# Altium schematic sheet Deserializer.SchDoc
size A
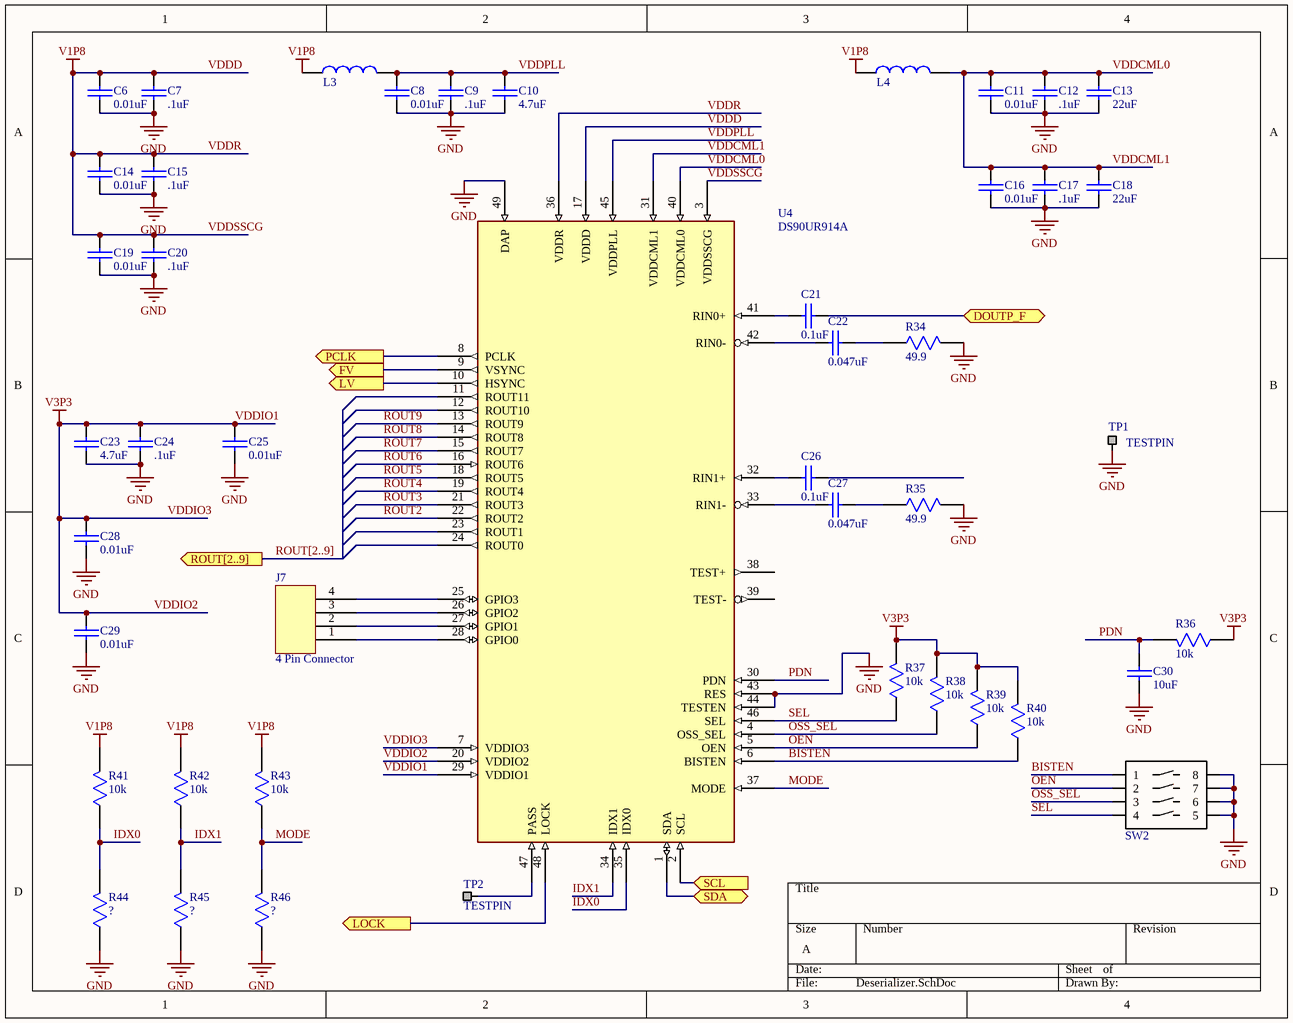
[diagram p0: Deserializer.SchDoc]

## Parts
C6  0.01uF  [SMD Capacitor 0603]
C7  .1uF  [SMD Capacitor 0603]
C8  0.01uF  [SMD Capacitor 0603]
C9  .1uF  [SMD Capacitor 0603]
C10  4.7uF  [SMD Capacitor 0603]
C11  0.01uF  [SMD Capacitor 0603]
C12  .1uF  [SMD Capacitor 0603]
C13  22uF  [SMD Capacitor 0603]
C14  0.01uF  [SMD Capacitor 0603]
C15  .1uF  [SMD Capacitor 0603]
C16  0.01uF  [SMD Capacitor 0603]
C17  .1uF  [SMD Capacitor 0603]
C18  22uF  [SMD Capacitor 0603]
C19  0.01uF  [SMD Capacitor 0603]
C20  .1uF  [SMD Capacitor 0603]
C21  0.1uF  [SMD CAP 0402]
C22  0.047uF  [SMD CAP 0402]
C23  4.7uF  [SMD Capacitor 0603]
C24  .1uF  [SMD Capacitor 0603]
C25  0.01uF  [SMD Capacitor 0603]
C26  0.1uF  [SMD CAP 0402]
C27  0.047uF  [SMD CAP 0402]
C28  0.01uF  [SMD Capacitor 0603]
C29  0.01uF  [SMD Capacitor 0603]
C30  10uF  [SMD Capacitor 0603]
J7  4 Pin Connector  [4Pin Verital 0.1"]
L3  Ferrite Bead  [BLM18KG601SN1D]  (value not drawn)
L4  Ferrite Bead  [BLM18KG601SN1D]  (value not drawn)
R34  49.9  [SMD RES 0402]
R35  49.9  [SMD RES 0402]
R36  10k  [SMD Resistor 0603]
R37  10k  [SMD Resistor 0603]
R38  10k  [SMD Resistor 0603]
R39  10k  [SMD Resistor 0603]
R40  10k  [SMD Resistor 0603]
R41  10k  [SMD Resistor 0603]
R42  10k  [SMD Resistor 0603]
R43  10k  [SMD Resistor 0603]
R44  ?  [SMD Resistor 0603]
R45  ?  [SMD Resistor 0603]
R46  ?  [SMD Resistor 0603]
SW2  SW_DIP_4Position  [218-4LPST]  (value not drawn)
TP1  TESTPIN  [TESTPIN]
TP2  TESTPIN  [TESTPIN]
U4  DS90UR914A  [WQFN48 for DS90UB914A]

## Ports
DOUTP_F (bidir), FV (out), LOCK (out), LV (out), PCLK (out), ROUT[2..9] (out), SCL (in), SDA (bidir)

## Nets
GND: C6.1 C7.1 C8.1 C9.1 C10.1 C11.1 C12.1 C13.1 C14.1 C15.1 C16.1 C17.1 C18.1 C19.1 C20.1 C23.1 C24.1 C25.1 C28.1 C29.1 C30.1 R34.1 R35.1 R44.0 R45.0 R46.0 SW2.5 SW2.6 SW2.7 SW2.8 TP1.1 U4.43(RES) U4.44(TESTEN) U4.49(DAP)
VDDD: C6.0 C7.0 C14.0 C15.0 C19.0 C20.0 L3.1 L4.1 R41.1 R42.1 R43.1 U4.3(VDDSSCG) U4.17(VDDD) U4.36(VDDR)  [also labelled V1P8, VDDR, VDDSSCG]
VDDIO1: C23.0 C24.0 C25.0 C28.0 C29.0 R36.0 R37.1 R38.1 R39.1 R40.1 U4.7(VDDIO3) U4.20(VDDIO2) U4.29(VDDIO1)  [also labelled V3P3, VDDIO2, VDDIO3]
BISTEN: R40.0 SW2.1 U4.6(BISTEN)
DOUTP_F: C21.1 ; port DOUTP_F
FV: U4.9(VSYNC) ; port FV
IDX0: R41.0 R44.1 U4.35(IDX0)
IDX1: R42.0 R45.1 U4.34(IDX1)
LOCK: U4.48(LOCK) ; port LOCK
LV: U4.10(HSYNC) ; port LV
MODE: R43.0 R46.1 U4.37(MODE)
OEN: R39.0 SW2.2 U4.5(OEN)
OSS_SEL: R38.0 SW2.3 U4.4(OSS_SEL)
PCLK: U4.8(PCLK) ; port PCLK
PDN: C30.0 R36.1 U4.30(PDN)
ROUT2: U4.22(ROUT2)
ROUT3: U4.21(ROUT3)
ROUT4: U4.19(ROUT4)
ROUT5: U4.18(ROUT5)
ROUT6: U4.16(ROUT6)
ROUT7: U4.15(ROUT7)
ROUT8: U4.14(ROUT8)
ROUT9: U4.13(ROUT9)
SCL: U4.2(SCL) ; port SCL
SDA: U4.1(SDA) ; port SDA
SEL: R37.0 SW2.4 U4.46(SEL)
VDDCML0: C11.0 C12.0 C13.0 C16.0 C17.0 C18.0 L4.2 U4.31(VDDCML1) U4.40(VDDCML0)  [also labelled VDDCML1]
VDDPLL: C8.0 C9.0 C10.0 L3.2 U4.45(VDDPLL)
NetC21_0: C21.0 U4.41(RIN0+)
NetC22_0: C22.0 U4.42(RIN0-)
NetC22_1: C22.1 R34.0
NetC26_0: C26.0 U4.32(RIN1+)
NetC27_0: C27.0 U4.33(RIN1-)
NetC27_1: C27.1 R35.0
NetJ7_1: J7.1 U4.28(GPIO0)
NetJ7_2: J7.2 U4.27(GPIO1)
NetJ7_3: J7.3 U4.26(GPIO2)
NetJ7_4: J7.4 U4.25(GPIO3)
NetTP2_1: TP2.1 U4.47(PASS)

Not connected (* = marked no-connect by the designer): C26 1; U4 11(ROUT11) 12(ROUT10) 23(ROUT1) 24(ROUT0) 38(TEST+) 39(TEST-)

## Buses and harness runs
bus ROUT[2..9] = port ROUT[2..9]

## Library data of the parts
C6-C30 = Capacitor: Value: C?
R34-R46 = Resistor: Value: ?
TP1 TP2 = TESTPIN: TESTPIN SINGLE PIN HEADER; Manufacturer 1: Sharon Long Industries; Manufacturer Part Number 1: Cut-it-yourself; Reel: TH; Supplier 1: Sharon Long Industries; Supplier 1 Part number: Cut-It-Yourself